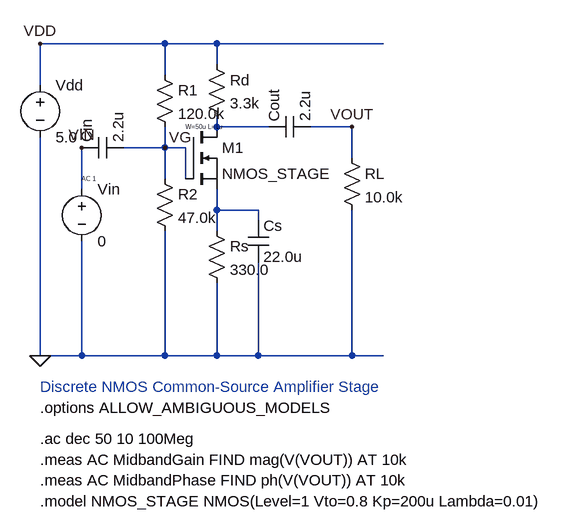
[diagram p0: schematic common_source_amp.asc]
common_source_amp.asc, the LTspice schematic file:
Version 4
SHEET 1 1200 800
WIRE 80 96 608 96
WIRE 80 576 608 576
WIRE 80 96 80 160
WIRE 80 240 80 576
WIRE 144 256 144 320
WIRE 144 400 144 576
WIRE 208 256 272 256
WIRE 272 96 272 144
WIRE 272 224 272 256
WIRE 272 256 272 304
WIRE 272 384 272 576
WIRE 272 256 304 256
WIRE 304 256 304 304
WIRE 352 96 352 128
WIRE 352 208 352 224
WIRE 352 320 352 352
WIRE 352 352 416 352
WIRE 352 352 352 384
WIRE 352 464 352 576
WIRE 416 352 416 368
WIRE 416 432 416 576
WIRE 352 224 432 224
WIRE 496 224 560 224
WIRE 560 224 560 272
WIRE 560 352 560 576
FLAG 80 96 VDD
FLAG 80 576 0
FLAG 144 256 VIN
FLAG 272 256 VG
FLAG 560 224 VOUT
SYMBOL voltage 80 144 R0
WINDOW 123 0 0 Left 0
WINDOW 39 0 0 Left 0
SYMATTR InstName Vdd
SYMATTR Value 5.0
SYMBOL voltage 144 304 R0
WINDOW 123 0 0 Left 0
WINDOW 39 0 0 Left 0
SYMATTR InstName Vin
SYMATTR Value 0
SYMATTR Value2 AC 1
SYMBOL cap 144 272 R270
WINDOW 123 0 0 Left 0
WINDOW 39 0 0 Left 0
SYMATTR InstName Cin
SYMATTR Value 2.2u
SYMBOL res 256 128 R0
WINDOW 123 0 0 Left 0
WINDOW 39 0 0 Left 0
SYMATTR InstName R1
SYMATTR Value 120.0k
SYMBOL res 256 288 R0
WINDOW 123 0 0 Left 0
WINDOW 39 0 0 Left 0
SYMATTR InstName R2
SYMATTR Value 47.0k
SYMBOL nmos 304 224 R0
WINDOW 123 0 0 Left 0
WINDOW 39 0 0 Left 0
SYMATTR InstName M1
SYMATTR Value NMOS_STAGE
SYMATTR Value2 W=50u L=1u
SYMBOL res 336 112 R0
WINDOW 123 0 0 Left 0
WINDOW 39 0 0 Left 0
SYMATTR InstName Rd
SYMATTR Value 3.3k
SYMBOL res 336 368 R0
WINDOW 123 0 0 Left 0
WINDOW 39 0 0 Left 0
SYMATTR InstName Rs
SYMATTR Value 330.0
SYMBOL cap 400 368 R0
WINDOW 123 0 0 Left 0
WINDOW 39 0 0 Left 0
SYMATTR InstName Cs
SYMATTR Value 22.0u
SYMBOL cap 432 240 R270
WINDOW 123 0 0 Left 0
WINDOW 39 0 0 Left 0
SYMATTR InstName Cout
SYMATTR Value 2.2u
SYMBOL res 544 256 R0
WINDOW 123 0 0 Left 0
WINDOW 39 0 0 Left 0
SYMATTR InstName RL
SYMATTR Value 10.0k
TEXT 80 624 Left 2 ;Discrete NMOS Common-Source Amplifier Stage
TEXT 80 656 Left 2 !.options ALLOW_AMBIGUOUS_MODELS
TEXT 80 704 Left 2 !.ac dec 50 10 100Meg
TEXT 80 736 Left 2 !.meas AC MidbandGain FIND mag(V(VOUT)) AT 10k
TEXT 80 768 Left 2 !.meas AC MidbandPhase FIND ph(V(VOUT)) AT 10k
TEXT 80 800 Left 2 !.model NMOS_STAGE NMOS(Level=1 Vto=0.8 Kp=200u Lambda=0.01)

The netlist it stands for:
* common_source_amp.asc
Vdd VDD 0 5.0
Vin VIN 0 0 AC 1
Cin VIN VG 2.2u
R1 VDD VG 120.0k
R2 VG 0 47.0k
M1 N001 VG N002 N002 NMOS_STAGE W=50u L=1u
Rd VDD N001 3.3k
Rs N002 0 330.0
Cs N002 0 22.0u
Cout N001 VOUT 2.2u
RL VOUT 0 10.0k
.model NMOS NMOS
.model PMOS PMOS
.lib standard.mos
* Discrete NMOS Common-Source Amplifier Stage
.options ALLOW_AMBIGUOUS_MODELS
.ac dec 50 10 100Meg
.meas AC MidbandGain FIND mag(V(VOUT)) AT 10k
.meas AC MidbandPhase FIND ph(V(VOUT)) AT 10k
.model NMOS_STAGE NMOS(Level=1 Vto=0.8 Kp=200u Lambda=0.01)
.backanno
.end